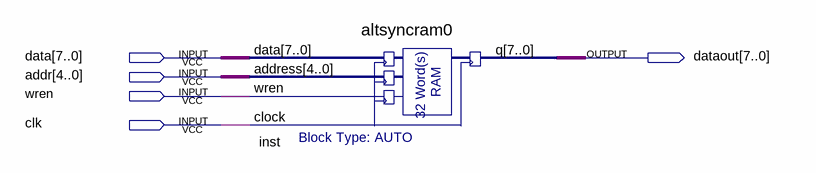
[diagram p0: schematic sheet]
// Quartus schematic lpm_sram.bdf as structural Verilog: 1 symbols, 5 pins
module lpm_sram (
  input  [7:0] data,
  input  [4:0] addr,
  input  wren,
  input  clk,
  output [7:0] dataout
);

  altsyncram0 inst (.data(data), .address(addr), .wren(wren), .clock(clk), .q(dataout));
endmodule
